# Altium project Node.PrjPcb
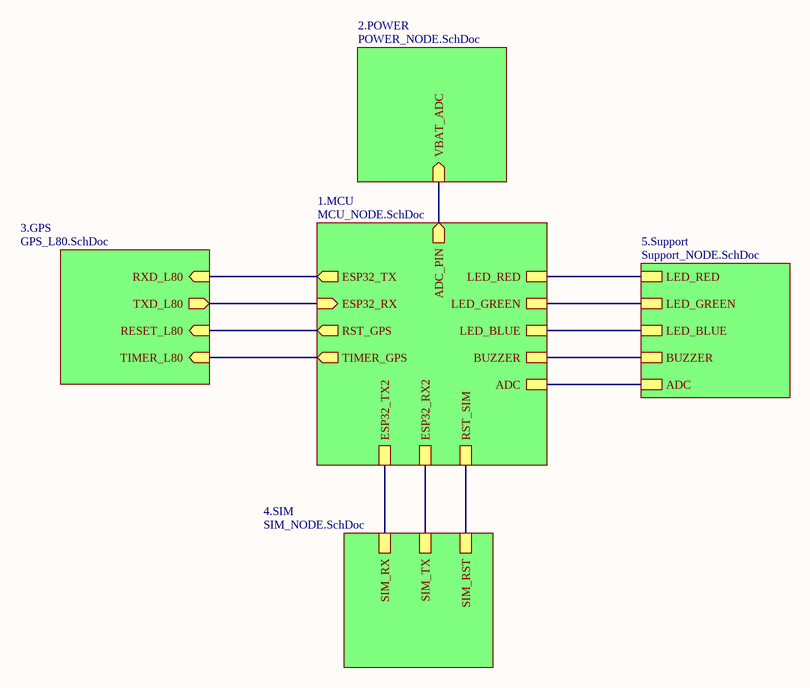
[diagram p0: Node.SchDoc]
5 sheets, 42 parts. Net scope: hierarchical (ports join the sheet entries above them; power ports are global).
Board file: NODE.PcbDoc
Sheets:
  Node.SchDoc
    1.MCU = MCU_NODE.SchDoc
    3.GPS = GPS_L80.SchDoc
    5.Support = Support_NODE.SchDoc
    4.SIM = SIM_NODE.SchDoc

## Sheet Node.SchDoc
size A

### Sub-sheets
1.MCU = MCU_NODE.SchDoc: ESP32_TX (out), ADC_PIN (out), ESP32_RX (in), RST_GPS (out), TIMER_GPS (out), LED_RED, LED_GREEN, LED_BLUE, BUZZER, ESP32_TX2, ESP32_RX2, RST_SIM, ADC
2.POWER = POWER_NODE.SchDoc (file not in this document): VBAT_ADC (in)
3.GPS = GPS_L80.SchDoc: RXD_L80 (in), TXD_L80 (out), RESET_L80 (in), TIMER_L80 (in)
4.SIM = SIM_NODE.SchDoc: SIM_RX, SIM_TX, SIM_RST
5.Support = Support_NODE.SchDoc: LED_RED, LED_GREEN, LED_BLUE, BUZZER, ADC

### Nets
NetP3_2: sheet 1.MCU/ESP32_RX2, sheet 4.SIM/SIM_TX
NetP3_3: sheet 1.MCU/ESP32_TX2, sheet 4.SIM/SIM_RX
NetP3_4: sheet 1.MCU/RST_SIM, sheet 4.SIM/SIM_RST
NetP4_1: sheet 1.MCU/LED_RED, sheet 5.Support/LED_RED
NetP4_3: sheet 1.MCU/LED_GREEN, sheet 5.Support/LED_GREEN
NetP4_4: sheet 1.MCU/LED_BLUE, sheet 5.Support/LED_BLUE
NetP5_2: sheet 1.MCU/ADC, sheet 5.Support/ADC
NetR14_2: sheet 1.MCU/BUZZER, sheet 5.Support/BUZZER
NetR19_2: sheet 1.MCU/RST_GPS, sheet 3.GPS/RESET_L80
NetU1_6: sheet 1.MCU/ADC_PIN, sheet 2.POWER/VBAT_ADC
NetU1_9: sheet 1.MCU/TIMER_GPS, sheet 3.GPS/TIMER_L80
NetU1_11: sheet 1.MCU/ESP32_TX, sheet 3.GPS/RXD_L80
NetU1_12: sheet 1.MCU/ESP32_RX, sheet 3.GPS/TXD_L80

## Sheet MCU_NODE.SchDoc
size A
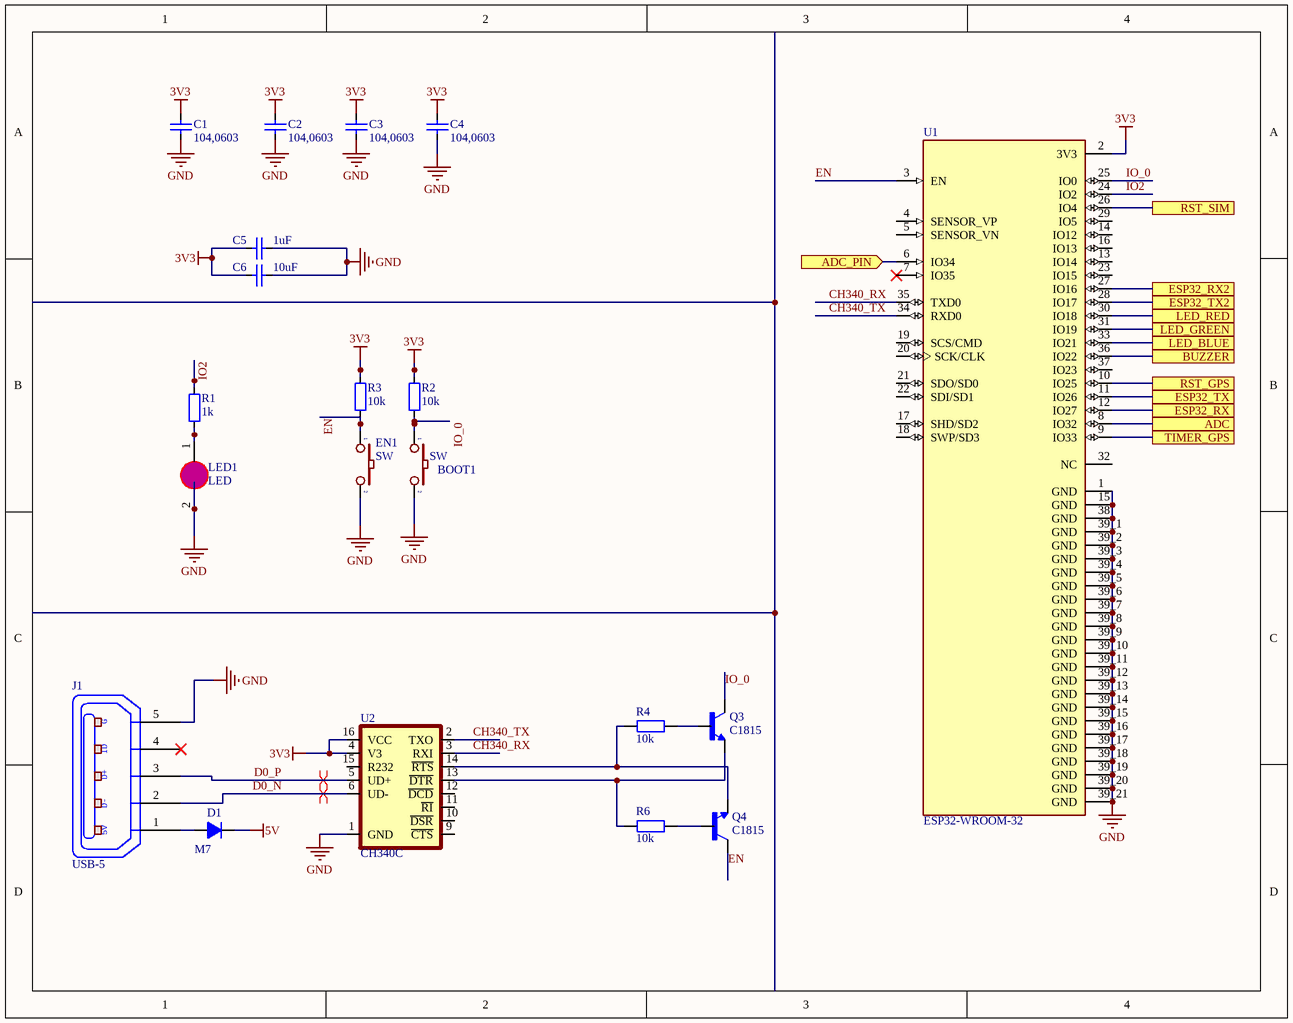
[diagram p1: MCU_NODE.SchDoc]

### Parts
BOOT1  SW  [SW-SMD]
C1  104,0603  [CAP_0603]
C2  104,0603  [CAP_0603]
C3  104,0603  [CAP_0603]
C4  104,0603  [CAP_0603]
C5  1uF  [CAP_0603]
C6  10uF  [CAP_0603]
D1  M7  [SMA]
EN1  SW  [SW-SMD]
J1  USB-5  [USB-M1]
LED1  LED  [LED0805]
Q3  C1815  [SOT95P240X97-3N]
Q4  C1815  [SOT95P240X97-3N]
R1  1k  [RES-SMD-0603]
R2  10k  [RES-SMD-0603]
R3  10k  [RES-SMD-0603]
R4  10k  [RES-SMD-0603]
R6  10k  [RES-SMD-0603]
U1  ESP32-WROOM-32  [MODULE_ESP32-WROOM-32]
U2  CH340C  [SOP-16]

### Ports
ADC, ADC_PIN (in), BUZZER, ESP32_RX, ESP32_RX2, ESP32_TX, ESP32_TX2, LED_BLUE, LED_GREEN, LED_RED, RST_GPS, RST_SIM, TIMER_GPS

### Nets
3V3: C1.2 C2.2 C3.2 C4.2 C5.1 C6.1 R2.1 R3.1 U1.2(3V3) U2.4(V3) U2.16(VCC)
5V: D1.2(K)
GND: BOOT1.2 C1.1 C2.1 C3.1 C4.1 C5.2 C6.2 EN1.2 J1.5(P5) LED1.2(K) U1.1(GND) U1.15(GND) U1.38(GND) U1.39_1(GND) U1.39_2(GND) U1.39_3(GND) U1.39_4(GND) U1.39_5(GND) U1.39_6(GND) U1.39_7(GND) U1.39_8(GND) U1.39_9(GND) U1.39_10(GND) U1.39_11(GND) U1.39_12(GND) U1.39_13(GND) U1.39_14(GND) U1.39_15(GND) U1.39_16(GND) U1.39_17(GND) U1.39_18(GND) U1.39_19(GND) U1.39_20(GND) U1.39_21(GND) U2.1(GND)
CH340_RX: U1.35(TXD0) U2.3(RXI)
CH340_TX: U1.34(RXD0) U2.2(TXO)
D0_N: J1.2(P2) U2.6(UD-)
D0_P: J1.3(P3) U2.5(UD+)
EN: EN1.1 Q4.3(C) R3.2 U1.3(EN)
IO2: R1.1 U1.24(IO2)
IO_0: BOOT1.1 Q3.3(C) R2.2 U1.25(IO0)
NetD1_1: D1.1(A) J1.1(P1)
NetLED1_1: LED1.1(A) R1.2
NetP3_2: U1.27(IO16) ; port ESP32_RX2
NetP3_3: U1.28(IO17) ; port ESP32_TX2
NetP3_4: U1.26(IO4) ; port RST_SIM
NetP4_1: U1.30(IO18) ; port LED_RED
NetP4_3: U1.31(IO19) ; port LED_GREEN
NetP4_4: U1.33(IO21) ; port LED_BLUE
NetP5_2: U1.8(IO32) ; port ADC
NetQ3_1: Q3.1(B) R4.2
NetQ3_2: Q3.2(E) R6.1 U2.13(~{DTR})
NetQ4_1: Q4.1(B) R6.2
NetQ4_2: Q4.2(E) R4.1 U2.14(~{RTS})
NetR14_2: U1.36(IO22) ; port BUZZER
NetR19_2: U1.10(IO25) ; port RST_GPS
NetU1_6: U1.6(IO34) ; port ADC_PIN
NetU1_9: U1.9(IO33) ; port TIMER_GPS
NetU1_11: U1.11(IO26) ; port ESP32_TX
NetU1_12: U1.12(IO27) ; port ESP32_RX

Not connected (* = marked no-connect by the designer): J1 4(P4)*; U1 4(SENSOR_VP) 5(SENSOR_VN) 7(IO35)* 13(IO14) 14(IO12) 16(IO13) 17(SHD/SD2) 18(SWP/SD3) 19(SCS/CMD) 20(SCK/CLK) 21(SDO/SD0) 22(SDI/SD1) 23(IO15) 29(IO5) 32(NC) 37(IO23); U2 9(~{CTS}) 10(~{DSR}) 11(~{RI}) 12(~{DCD}) 15(R232)

### Layout directives
differential pair: D0_N, D0_P

### Notes on the sheet
- (in symbol USB-5) G; ID; D+; D-; 5V

### Library data of the parts
BOOT1 EN1 = SW2: Switch button 2 pin; Value: SW chip 2 pin
C1-C6 = CapSMD: Capacitor; Value: 33p; Published: 8-Jun-2000; LatestRevisionDate: 17-Jul-2002; LatestRevisionNote: Re-released for DXP Platform.; PackageReference: RAD-0.3; Publisher: Altium Limited
D1 = D1A: Diode 1A; Value: 1N4007
J1 = USB-5: Manufacturer: FCI; Manufacturer Part Number: 10118193-0001LF; Connector Type: USB - micro B; Number of Contacts: 5; Gender: Receptacle; Specifications: USB 2.0; .Creator: MM; .Checked PCB: RF; Supplier 1: Digi-Key; RoHS: RoHS Compliant; Category: Connectors, Interconnects; Stock 1: 28642; Pricing 1: 1=0.46, 10=0.433, 25=0.3712, 50=0.3156, 100=0.3032, 250=0.27224, 500=0.25988 (USD); Packaging: Cut Tape (CT); Mounting Type: Surface Mount, Right Angle, Horizontal; Features: Shielded, Solder Retention; Ingress Protection: -; ComponentLink1URL: http://portal.fciconnect.com/Comergent//fci/drawing/10118193.pdf; ComponentLink1Description: http://portal.fciconnect.com/Comergent//fci/drawing/10118193.pdf; Supplier Part Number 1: 609-4616-1-ND; .Checked SCH: MM
LED1 = LED0805: LED SMD 0805
Q3 Q4 = BC817: Bipolar (BJT) Transistor NPN 45V 500mA 100MHz 250mW Surface Mount TO-236AB; MF: Rectron; MP: BC817; Value: *; SnapEDA_Link: https://www.snapeda.com/parts/BC817/Rectron/view-part/?ref=snap; Availability: In Stock; Purchase-URL: https://pricing.snapeda.com/search/part/BC817/?ref=eda; Package: SOT-23-3 Rectron; Price: None; Check_prices: https://www.snapeda.com/parts/BC817/Rectron/view-part/?ref=eda
R1-R4 R6 = Resistor - SMD: Resistor SMD; Manufacturer: Generic Components; Class: Passive; Published: 08/06/2000; Publisher: Altium Hobart Technology Centre
U1 = ESP32-WROOM-32: Bluetooth, WiFi 802.11b/g/n, Bluetooth v4.2 +EDR, Class 1, 2 and 3 Transceiver Module 2.4GHz ~ 2.5GHz Antenna Not Included, U.FL Surface Mount; MF: Espressif Systems; Price: None; Availability: In Stock; MP: ESP32-WROOM-32; Package: Module Espressif Systems; SnapEDA_Link: https://www.snapeda.com/parts/ESP32-WROOM-32/Espressif+Systems/view-part/?ref=snap; Check_prices: https://www.snapeda.com/parts/ESP32-WROOM-32/Espressif+Systems/view-part/?ref=eda; Value: *; Purchase-URL: https://pricing.snapeda.com/search/part/ESP32-WROOM-32/?ref=eda
U2 = CH340C: USB to serial chip CH340; MF: WCH; Package: Package; Check_prices: https://www.snapeda.com/parts/CH340C/WCH/view-part/5428851/?ref=eda; Value: *; Price: None; MP: CH340C; Availability: Unavailable; SnapEDA_Link: https://www.snapeda.com/parts/CH340C/WCH/view-part/5428851/?ref=snap

## Sheet GPS_L80.SchDoc
size A
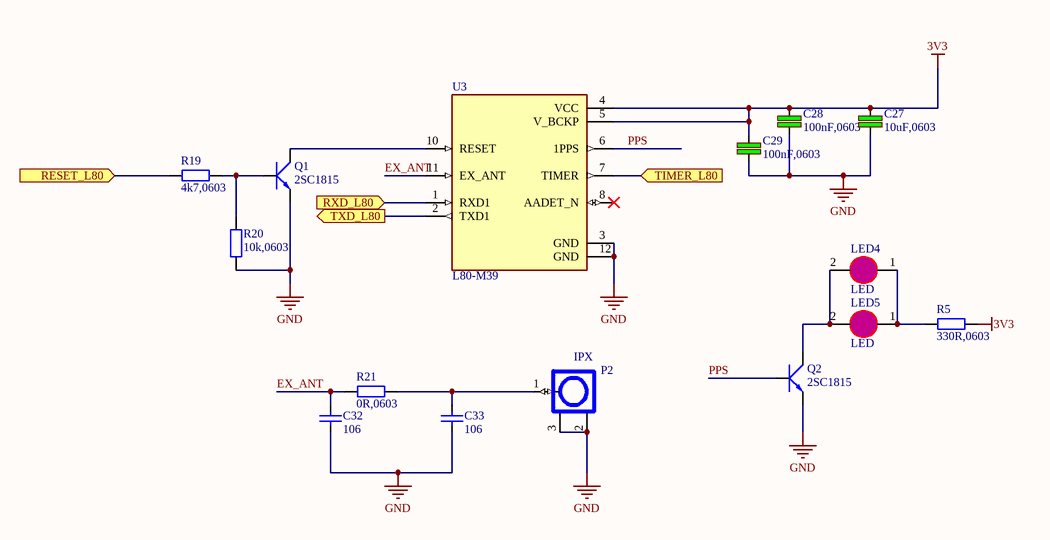
[diagram p2: GPS_L80.SchDoc]

### Parts
C27  value 10uF,0603  [CAP_0603]  (hidden comment: 4.7uF)
C28  value 100nF,0603  [CAP_0603]  (hidden comment: 4.7uF)
C29  value 100nF,0603  [CAP_0603]  (hidden comment: 4.7uF)
C32  106  [CAP_0603]
C33  106  [CAP_0603]
LED4  LED  [LED0805]
LED5  LED  [LED0805]
P2  IPX  [IPXS]
Q1  2SC1815  [SOT23]
Q2  2SC1815  [SOT23-321]
R5  330R,0603  [RES-SMD-0603]
R19  4k7,0603  [RES-SMD-0603]
R20  10k,0603  [RES-SMD-0603]
R21  0R,0603  [RES-SMD-0603]
U3  L80-M39  [XCVR_L80-M39]

### Ports
RESET_L80 (in), RXD_L80 (in), TIMER_L80 (in), TXD_L80 (out)

### Nets
3V3: C27.2 C28.2 C29.2 R5.1 U3.4(VCC) U3.5(V_BCKP)
GND: C27.1 C28.1 C29.1 C32.1 C33.1 P2.2 P2.3 Q1.1(E) Q2.1(E) R20.1 U3.3(GND) U3.12(GND)
EX_ANT: C32.2 R21.2 U3.11(EX_ANT)
PPS: Q2.3(B) U3.6(1PPS)
NetC33_2: C33.2 P2.1 R21.1
NetLED4_1: LED4.1(A) LED5.1(A) R5.2
NetLED4_2: LED4.2(K) LED5.2(K) Q2.2(C)
NetQ1_2: Q1.2(C) U3.10(RESET)
NetQ1_3: Q1.3(B) R19.1 R20.2
NetR19_2: R19.2 ; port RESET_L80
NetU1_9: U3.7(TIMER) ; port TIMER_L80
NetU1_11: U3.1(RXD1) ; port RXD_L80
NetU1_12: U3.2(TXD1) ; port TXD_L80

Not connected (* = marked no-connect by the designer): U3 8(AADET_N)*

### Library data of the parts
C27-C29 = C: 4.7µF ±10% 35V Ceramic Capacitor X5R 0805 (2012 Metric); Manufacturer: Samsung Electro-Mechanics; Part number: CL21A475KLCLQNC; User_Description: CAP CER 4.7UF 35V X5R 0805; Category: CAPACITOR; Package: 0805
C32 C33 = CapSMD: Capacitor; Value: 33p; Published: 8-Jun-2000; LatestRevisionDate: 17-Jul-2002; LatestRevisionNote: Re-released for DXP Platform.; PackageReference: RAD-0.3; Publisher: Altium Limited
LED4 LED5 = LED0805: LED SMD 0805
P2 = IPXSx66: Antenna GSM GPS; Manufacturer: TE Connectivity AMP Connectors; Part number: 2334884-1; User_Description: UMCC MICRO-COAX RECEPTACLE, GEN; Category: Connectors; Package: SMD
Q1 Q2 = 2SC1815: NPN 600mW, ECB; Value: C1815
R5 R19-R21 = Resistor - SMD: as R1 on sheet MCU_NODE; Published: 08/06/2000; Publisher: Altium Hobart Technology Centre
U3 = L80-M39: L80 is an ultra compact GPS POT (Patch on Top) module with an embedded 15.0mm Ã— 15.0mm Ã— 4.0mm patch antenna.; MF: Quectel; Check_prices: https://www.snapeda.com/parts/L80-M39/Quectel/view-part/51186/?ref=eda; Price: None; Package: None; Purchase-URL: https://pricing.snapeda.com/search/part/L80-M39/?ref=eda; Value: *; MP: L80-M39; SnapEDA_Link: https://www.snapeda.com/parts/L80-M39/Quectel/view-part/51186/?ref=snap; Availability: Warning

## Sheet Support_NODE.SchDoc
size A
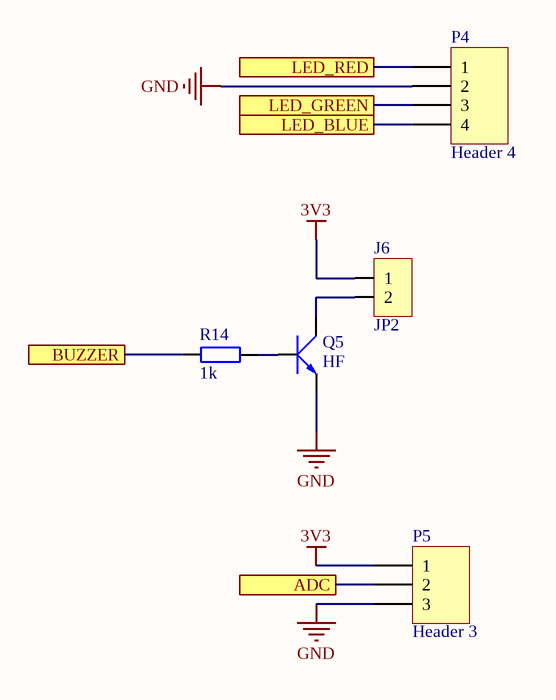
[diagram p3: Support_NODE.SchDoc]

### Parts
J6  JP2  [JP2-D1T]
P4  Header 4  [Header 4]
P5  Header 3  [Header 3]
Q5  HF  [SOT23]
R14  1k  [RES-SMD-0603]

### Ports
ADC, BUZZER, LED_BLUE, LED_GREEN, LED_RED

### Nets
3V3: J6.1 P5.1
GND: P4.2 P5.3 Q5.2(E)
NetJ6_2: J6.2 Q5.3(C)
NetP4_1: P4.1 ; port LED_RED
NetP4_3: P4.3 ; port LED_GREEN
NetP4_4: P4.4 ; port LED_BLUE
NetP5_2: P5.2 ; port ADC
NetQ5_1: Q5.1(B) R14.1
NetR14_2: R14.2 ; port BUZZER

### Library data of the parts
J6 = JP2: WR-PHD 2.54 mm Angled Socket Header; Manufacturer: W¨¹rth Elektronik eiSos GmbH; partNo: 613002143121; ComponentLink1 Description: Manufacturer; ComponentLink2 Description: Datasheet; NoPins: 02; Created Date: 29 March 2013; ComponentLink1URL: http://www.we-online.com; ComponentLink2URL: http://katalog.we-online.de/em/datasheet/6130xx143121.pdf; Created by: Karrer Zheng
P4 = Header 4: Header, 4-Pin; LatestRevisionDate: 17-Jul-2002; LatestRevisionNote: Re-released for DXP Platform.; Publisher: Altium Limited
P5 = Header 3: Header, 3-Pin; LatestRevisionDate: 17-Jul-2002; LatestRevisionNote: Re-released for DXP Platform.; Publisher: Altium Limited
Q5 = C1815 HF SMD: NPN transistor; Value: C9014
R14 = Resistor - SMD: as R1 on sheet MCU_NODE; Published: 08/06/2000; Publisher: Altium Hobart Technology Centre

## Sheet SIM_NODE.SchDoc
size A
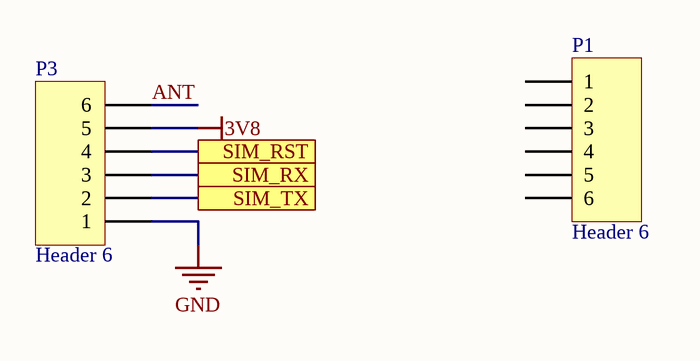
[diagram p4: SIM_NODE.SchDoc]

### Parts
P1  Header 6  [Header 6]
P3  Header 6  [Header 6]

### Ports
SIM_RST, SIM_RX, SIM_TX

### Nets
3V8: P3.5
GND: P3.1
ANT: P3.6
NetP3_2: P3.2 ; port SIM_TX
NetP3_3: P3.3 ; port SIM_RX
NetP3_4: P3.4 ; port SIM_RST

Not connected (* = marked no-connect by the designer): P1 1 2 3 4 5 6

### Library data of the parts
P1 P3 = Header 6: Header, 6-Pin; LatestRevisionDate: 17-Jul-2002; LatestRevisionNote: Re-released for DXP Platform.; Publisher: Altium Limited

## Nets that join several sheets
3V3: MCU_NODE (11 pins), GPS_L80 (6 pins), Support_NODE (J6.1 P5.1)
GND: MCU_NODE (35 pins), GPS_L80 (12 pins), Support_NODE (P4.2 P5.3 Q5.2), SIM_NODE (P3.1)
NetP3_2: MCU_NODE (U1.27), SIM_NODE (P3.2)
NetP3_3: MCU_NODE (U1.28), SIM_NODE (P3.3)
NetP3_4: MCU_NODE (U1.26), SIM_NODE (P3.4)
NetP4_1: MCU_NODE (U1.30), Support_NODE (P4.1)
NetP4_3: MCU_NODE (U1.31), Support_NODE (P4.3)
NetP4_4: MCU_NODE (U1.33), Support_NODE (P4.4)
NetP5_2: MCU_NODE (U1.8), Support_NODE (P5.2)
NetR14_2: MCU_NODE (U1.36), Support_NODE (R14.2)
NetR19_2: MCU_NODE (U1.10), GPS_L80 (R19.2)
NetU1_9: MCU_NODE (U1.9), GPS_L80 (U3.7)
NetU1_11: MCU_NODE (U1.11), GPS_L80 (U3.1)
NetU1_12: MCU_NODE (U1.12), GPS_L80 (U3.2)